# Altium schematic sheet DC-DC.SchDoc: Наименование
size 209 x 297 mm; ApprovedBy: Утвердил; CheckedBy: Проверил; Author: Разработал; CompanyName: Организация; DrawnBy: Н.Контр; Engineer: Т.Контр; SheetNumber: 2; SheetTotal: 6; PageSetup: Record=PageOptions|CenterHorizontal=True|CenterVertical=True|PrintScale=0.94|XCorrection=1.00|YCorrection=1.00|PrintKind=1|BorderSize=5000000|LeftOffset=0|BottomOffset=0|Orientation=1|PaperLength=1000|PaperWidth=1000|Scale=100|PaperSource=7|PrintQuality=-4|MediaType=1|DitherType=10|PaperKind=A4|PrintScaleMode=1; DecimalNumber: Децимальный номер; HeadOfSector: Нач. сектора; MainDevice: Перв.примен.; Name: Наименование; DocumentName: Sheet1.SCHDOC
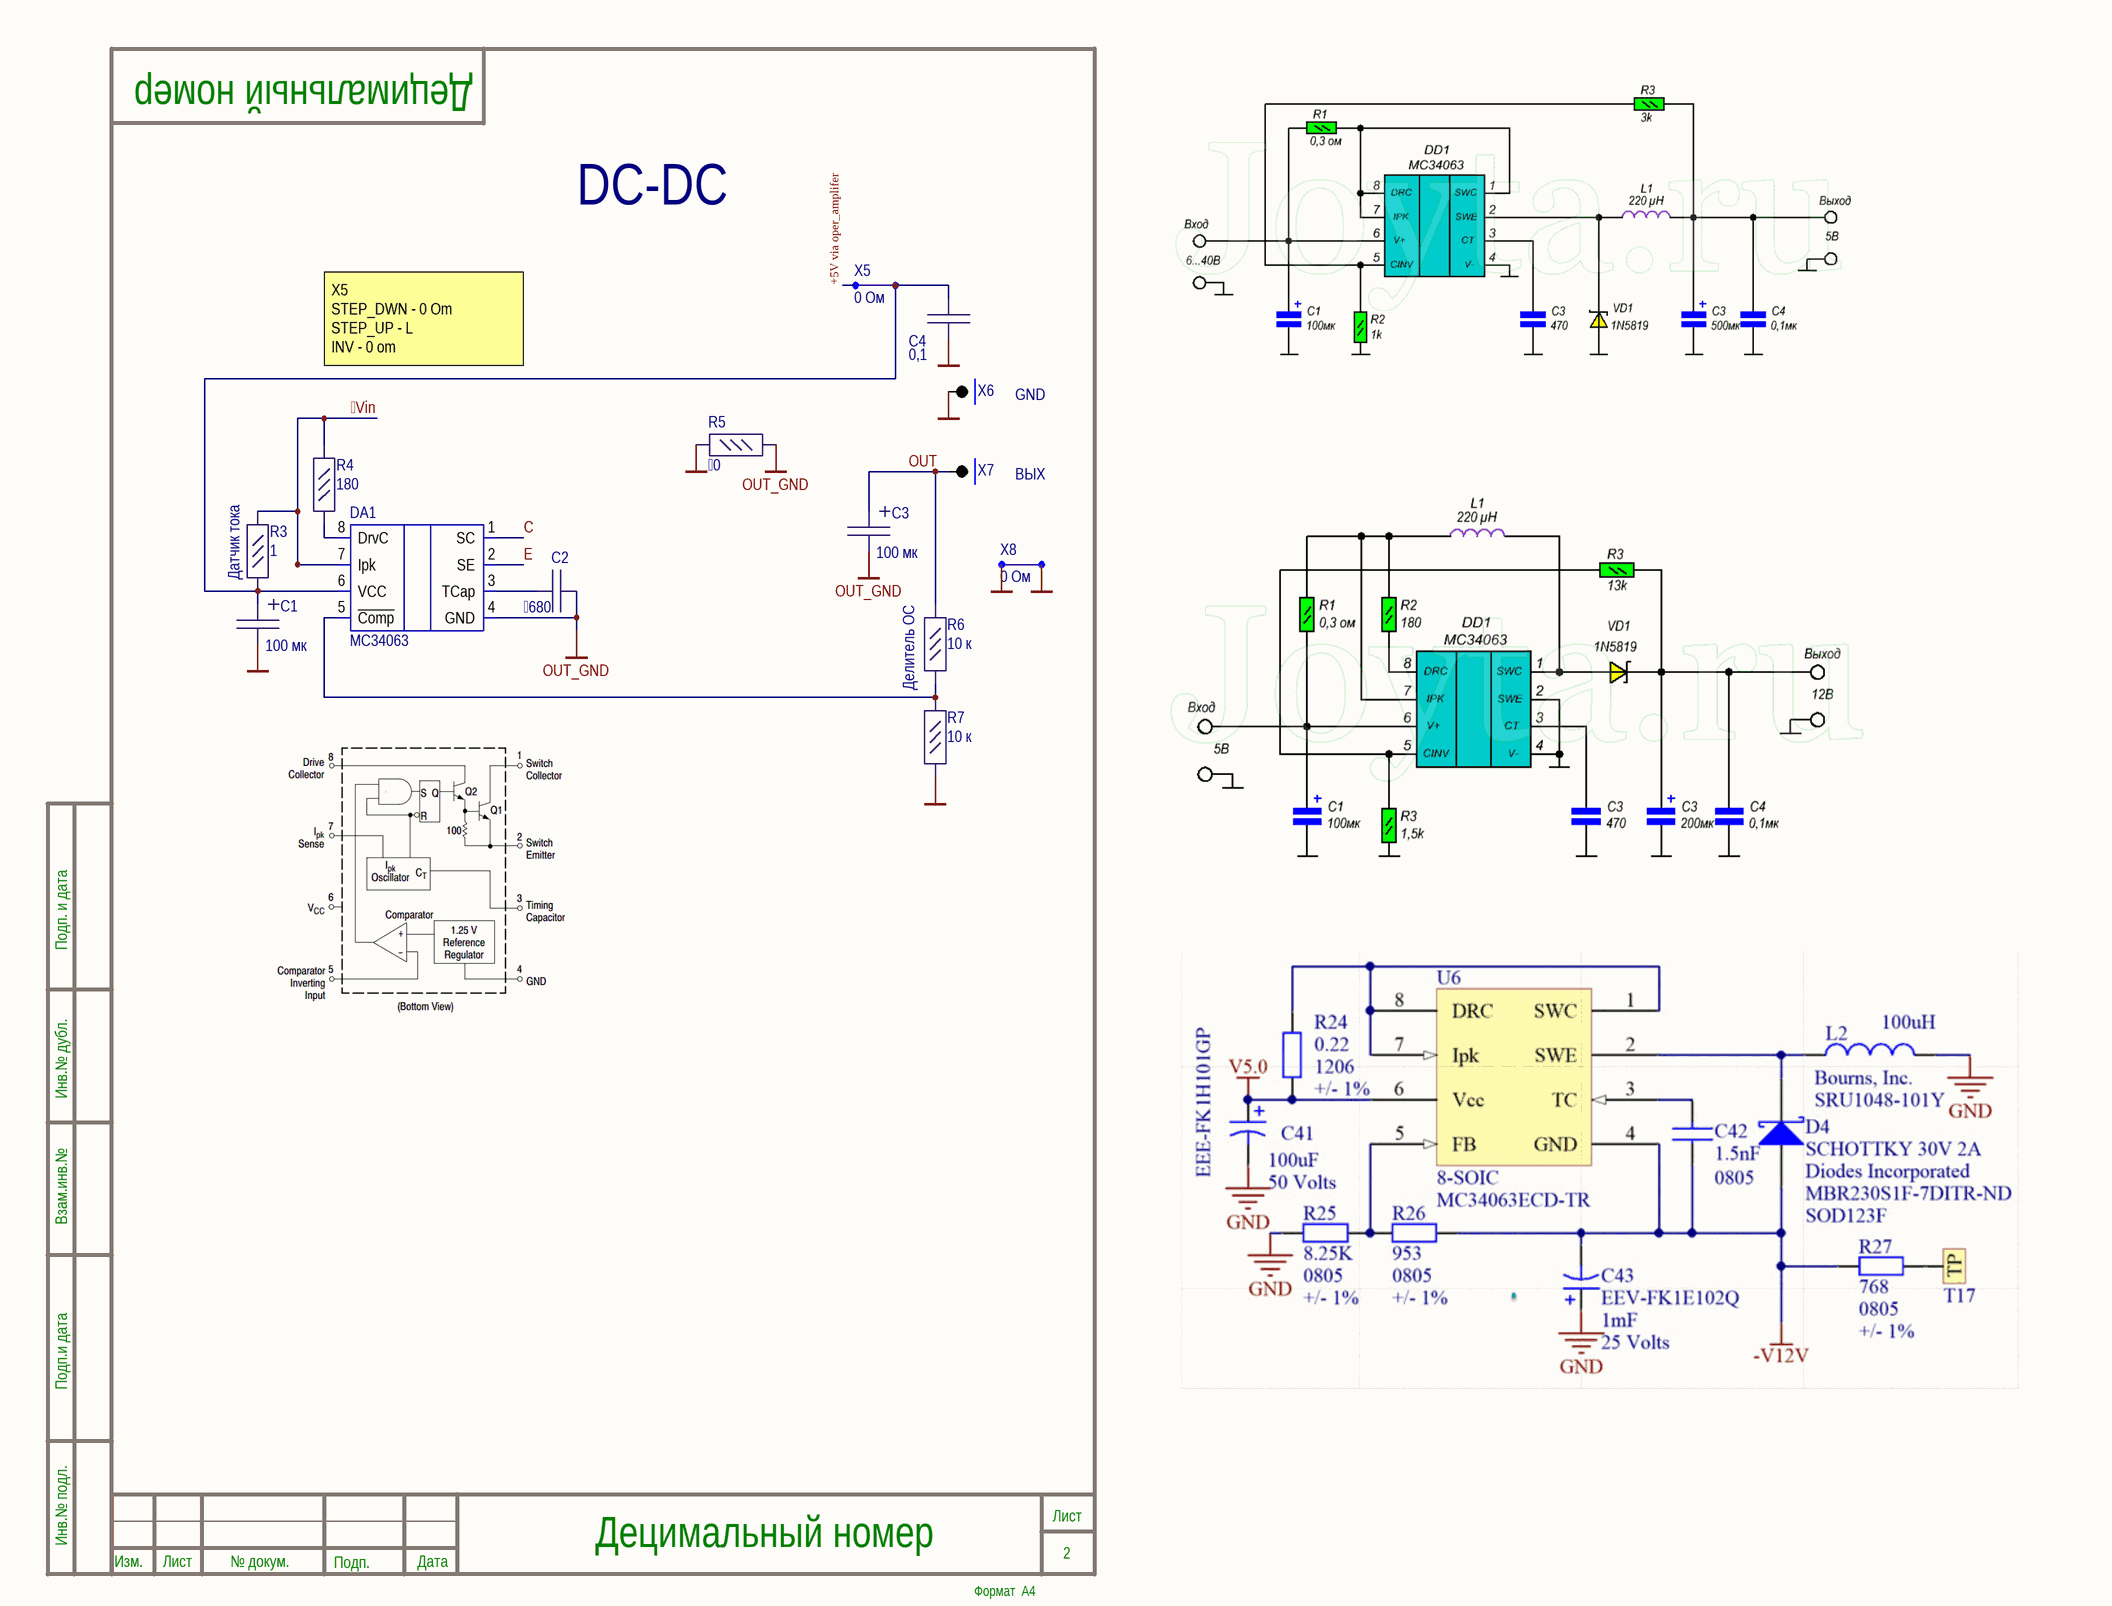
[diagram p0: DC-DC.SchDoc]

## Parts
C1  100 мк  [SMD_al_cap_0605_6.3]
C2  680  [C_0805]
C3  100 мк  [SMD_al_cap_0605_6.3]
C4  0,1  [C_0805]
DA1  MC34063  [SO-8]
R3  1  [R_0805]
R4  180  [R_0805]
R5  0  [R_0805]
R6  10 к  [R_0805]
R7  10 к  [R_0805]
X5  0 Ом  [jumper]
X6  КТ  [PLS-1]  (value not drawn)
X7  КТ  [PLS-1]  (value not drawn)
X8  0 Ом  [jumper]

## Nets
GND: C1.2 C4.2 R5.1 R7.2 X6.1 X8.1 X8.2
OUT_GND: C2.1 C3.2 DA1.4(GND) R5.2
Vin: DA1.7(Ipk) R3.1 R4.1
+5V via oper_amplifer: X5.1
C: DA1.1(SC)
E: DA1.2(SE)
OUT: C3.1 R6.1 X7.1
NetC1_1: C1.1 C4.1 DA1.6(VCC) R3.2 X5.2
NetC2_2: C2.2 DA1.3(TCap)
NetDA1_5: DA1.5(~{Comp}) R6.2 R7.1
NetDA1_8: DA1.8(DrvC) R4.2

## Notes on the sheet
- DC-DC
- X5
  STEP_DWN - 0 Om
  STEP_UP - L
  INV - 0 om
- (near X6) GND
- ВЫХ
- (near R3) Датчик тока
- Делитель ОС
- Подп. и дата
- Инв.№ дубл.
- Взам.инв.№
- Подп.и дата
- Инв.№ подл.
- Изм.
- Лист
- № докум.
- Подп.
- Дата
- Формат  A4

## Library data of the parts
C1 C3 = TAJB107K004RNJ: CAP TANT 100UF 10% 4V 1411; Manufacturer: AVX Corporation; Value: 100µF; Part Number: TAJB107K004RNJ; ComponentLink1URL: http://datasheets.avx.com/TAJ.pdf; ComponentLink1Description: Datasheet; Component Type: Tantalum Capacitor
C2 C4 = GRM188R72A104KA35D: CAP CER 0.1UF 100V X7R 0603; Manufacturer: Murata Electronics; Value: 0.1µF; Part Number: GRM188R72A104KA35D; ComponentLink1URL: https://www.murata.com/~/media/webrenewal/support/library/catalog/products/capacitor/mlcc/c02e.ashx?la=en-us; ComponentLink1Description: Datasheet; Component Type: Capasitor
R3-R5 = CR0603-FX-1002ELF: RES SMD 10K OHM 1% 1/10W 0603; Manufacturer: Bourns Inc.; Value: 10 к; Part Number: CR0603-FX-1002ELF; ComponentLink1URL: https://www.bourns.com/pdfs/chpreztr.pdf; ComponentLink1Description: Datasheet; Component Type: Resistor
R6 R7 = CR0603-FX-1002ELF: RES SMD 10K OHM 1% 1/10W 0603; Manufacturer: Bourns Inc.; Part Number: CR0603-FX-1002ELF; Value: 10 к; ComponentLink1URL: https://www.bourns.com/pdfs/chpreztr.pdf; ComponentLink1Description: Datasheet; Component Type: Resistor
X5 X8 = 0 Ohm (0805)